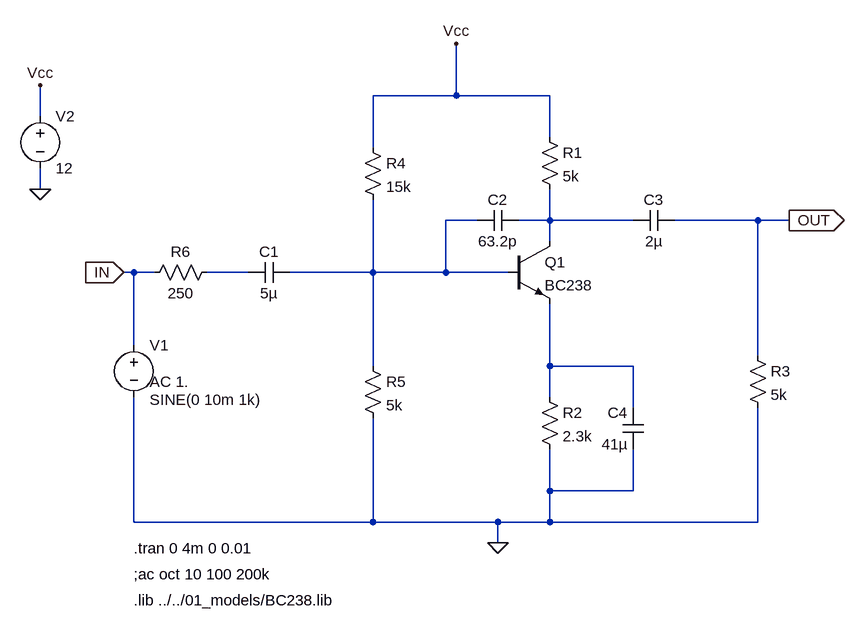
[diagram p0: schematic ceamp_06_02_01.asc]
ceamp_06_02_01.asc, the LTspice schematic file:
Version 4
SHEET 1 1156 680
WIRE 528 -112 528 -192
WIRE 528 -112 400 -112
WIRE 672 -112 528 -112
WIRE -112 -80 -112 -128
WIRE 672 -48 672 -112
WIRE 400 -32 400 -112
WIRE -112 32 -112 0
WIRE 560 80 512 80
WIRE 672 80 672 32
WIRE 672 80 624 80
WIRE 800 80 672 80
WIRE 992 80 864 80
WIRE 1040 80 992 80
WIRE 672 112 672 80
WIRE 32 160 16 160
WIRE 64 160 32 160
WIRE 208 160 144 160
WIRE 400 160 400 48
WIRE 400 160 272 160
WIRE 512 160 512 80
WIRE 512 160 400 160
WIRE 608 160 512 160
WIRE 32 272 32 160
WIRE 992 288 992 80
WIRE 400 304 400 160
WIRE 672 304 672 208
WIRE 800 304 672 304
WIRE 672 352 672 304
WIRE 800 368 800 304
WIRE 672 496 672 432
WIRE 800 496 800 432
WIRE 800 496 672 496
WIRE 32 544 32 352
WIRE 400 544 400 384
WIRE 400 544 32 544
WIRE 592 544 400 544
WIRE 672 544 672 496
WIRE 672 544 592 544
WIRE 992 544 992 368
WIRE 992 544 672 544
WIRE 592 576 592 544
FLAG 592 576 0
FLAG -112 32 0
FLAG -112 -128 Vcc
FLAG 528 -192 Vcc
FLAG 16 160 IN
IOPIN 16 160 In
FLAG 1040 80 OUT
IOPIN 1040 80 Out
SYMBOL npn 608 112 R0
SYMATTR InstName Q1
SYMATTR Value BC238
SYMBOL res 656 -64 R0
SYMATTR InstName R1
SYMATTR Value 5k
SYMBOL res 656 336 R0
SYMATTR InstName R2
SYMATTR Value 2.3k
SYMBOL res 976 272 R0
SYMATTR InstName R3
SYMATTR Value 5k
SYMBOL res 384 -48 R0
SYMATTR InstName R4
SYMATTR Value 15k
SYMBOL res 384 288 R0
SYMATTR InstName R5
SYMATTR Value 5k
SYMBOL res 160 144 R90
WINDOW 0 0 56 VBottom 2
WINDOW 3 32 56 VTop 2
SYMATTR InstName R6
SYMATTR Value 250
SYMBOL cap 272 144 R90
WINDOW 0 0 32 VBottom 2
WINDOW 3 32 32 VTop 2
SYMATTR InstName C1
SYMATTR Value 5µ
SYMBOL cap 624 64 R90
WINDOW 0 0 32 VBottom 2
WINDOW 3 32 32 VTop 2
SYMATTR InstName C2
SYMATTR Value 63.2p
SYMBOL cap 864 64 R90
WINDOW 0 0 32 VBottom 2
WINDOW 3 32 32 VTop 2
SYMATTR InstName C3
SYMATTR Value 2µ
SYMBOL cap 816 432 R180
WINDOW 0 24 56 Left 2
WINDOW 3 24 8 Left 2
SYMATTR InstName C4
SYMATTR Value 41µ
SYMBOL voltage 32 256 R0
WINDOW 3 24 100 Left 2
WINDOW 123 24 72 Left 2
WINDOW 39 0 0 Left 2
SYMATTR Value SINE(0 10m 1k)
SYMATTR Value2 AC 1.
SYMATTR InstName V1
SYMBOL voltage -112 -96 R0
WINDOW 123 0 0 Left 2
WINDOW 39 0 0 Left 2
SYMATTR InstName V2
SYMATTR Value 12
TEXT 32 584 Left 2 !.tran 0 4m 0 0.01
TEXT 32 624 Left 2 !;ac oct 10 100 200k
TEXT 32 664 Left 2 !.lib ../../01_models/BC238.lib

The netlist it stands for:
* ceamp_06_02_01.asc
Q1 N002 N001 N004 0 BC238
R1 Vcc N002 5k
R2 N004 0 2.3k
R3 OUT 0 5k
R4 Vcc N001 15k
R5 N001 0 5k
R6 N003 IN 250
C1 N001 N003 5µ
C2 N002 N001 63.2p
C3 OUT N002 2µ
C4 0 N004 41µ
V1 IN 0 SINE(0 10m 1k) AC 1.
V2 Vcc 0 12
.model NPN NPN
.model PNP PNP
.lib standard.bjt
.tran 0 4m 0 0.01
;ac oct 10 100 200k
.lib ../../01_models/BC238.lib
.backanno
.end